# EAGLE design mic-preamp (EAGLE 6.5.0)
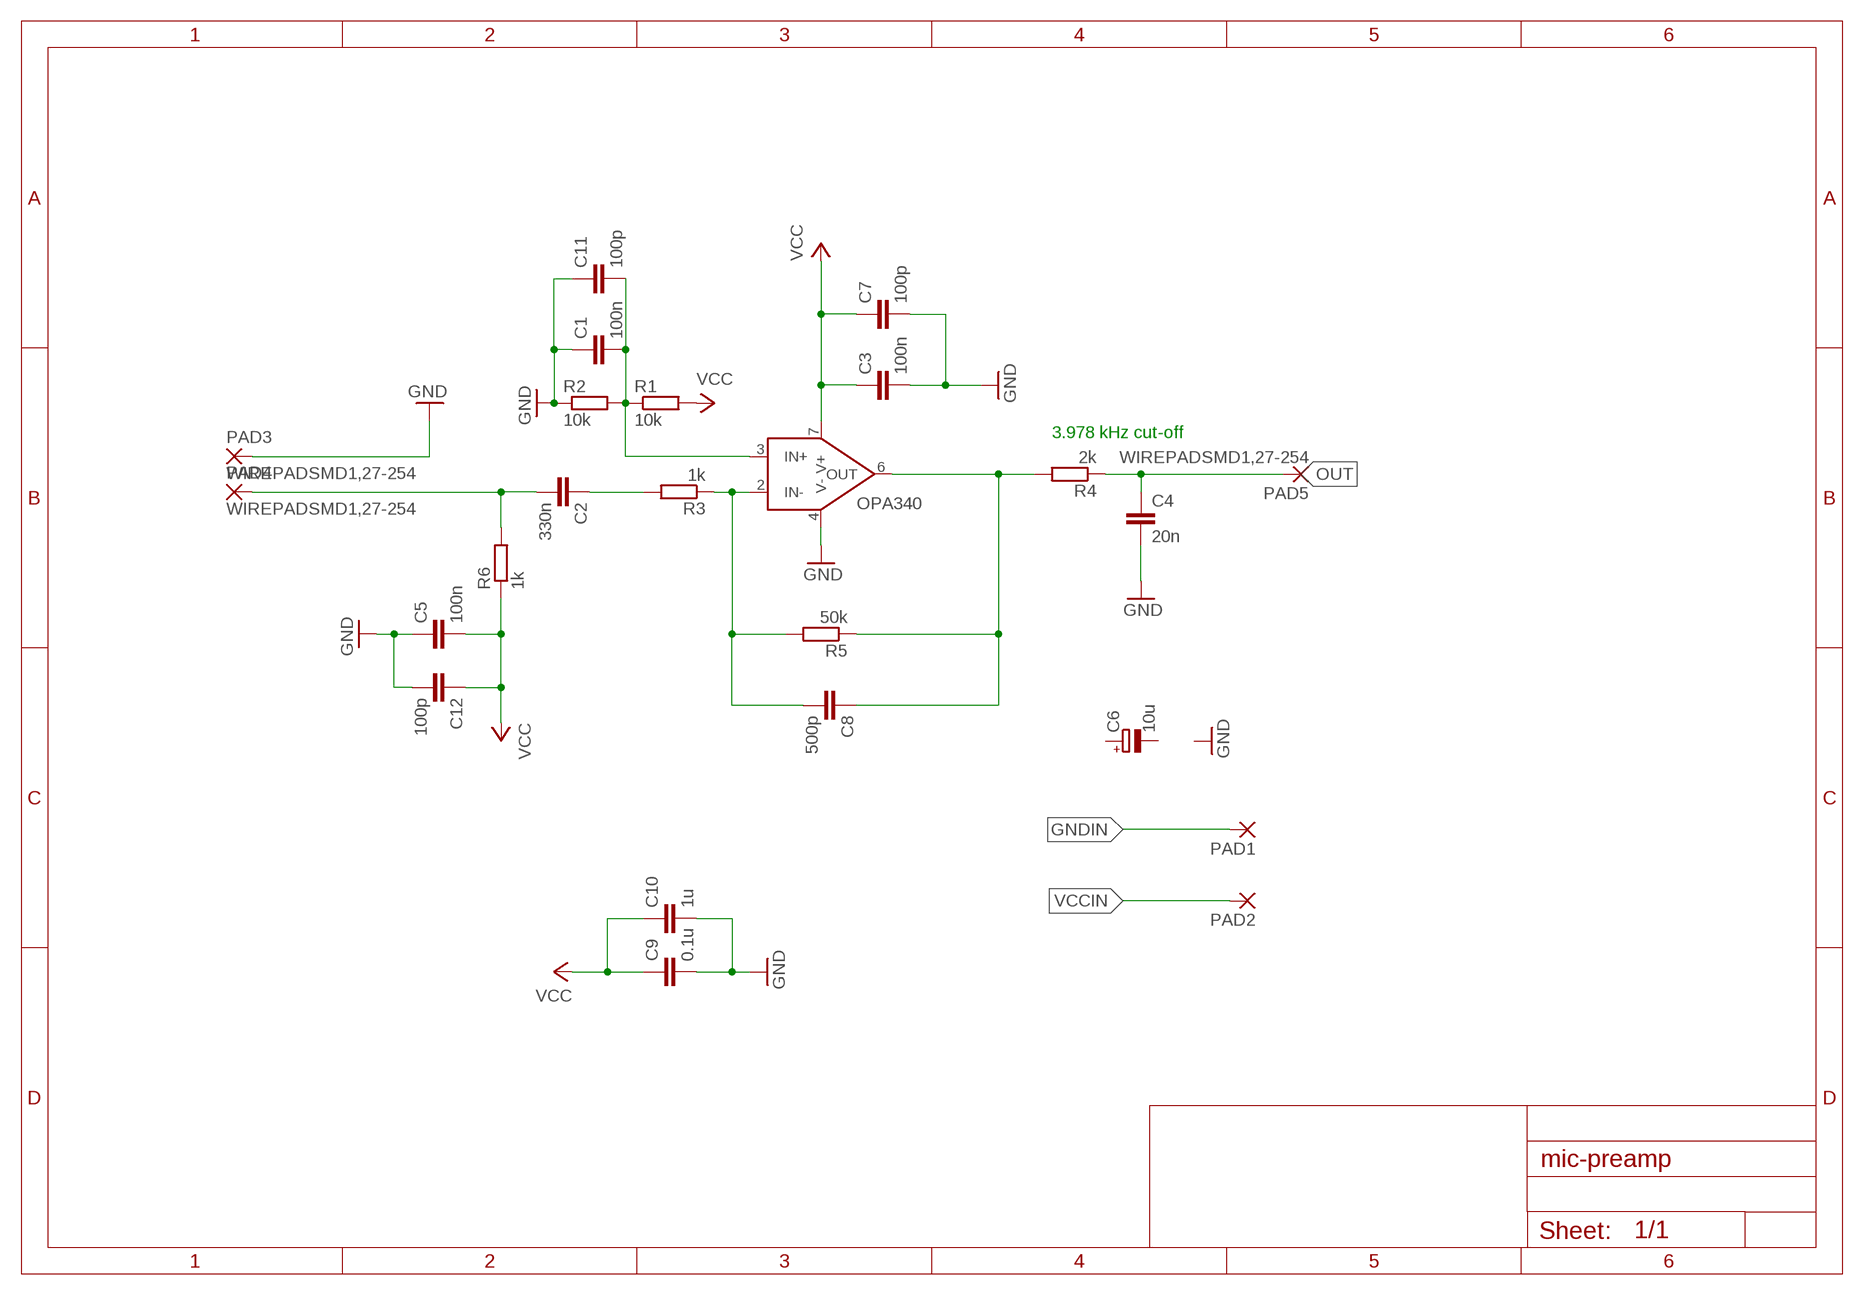
[diagram p0: schematic, sheet 1]

## Parts
C1  100n  C-EUC0805  [C0805]
C2  330n  C-EUC0805  [C0805]
C3  100n  C-EUC0805  [C0805]
C4  20n  C-EUC0805  [C0805]
C5  100n  C-EUC0805  [C0805]
C6  10u  CPOL-EUE2,5-6E  [E2,5-6E]
C7  100p  C-EUC0805  [C0805]
C8  500p  C-EUC0805  [C0805]
C9  0.1u  C-EUC0805  [C0805]
C10  1u  C-EUC0805  [C0805]
C11  100p  C-EUC0805  [C0805]
C12  100p  C-EUC0805  [C0805]
OPA340  OPA340  [DIL08]
PAD1  WIREPADSMD2,54-5,08  [SMD2,54-5,08]
PAD2  WIREPADSMD2,54-5,08  [SMD2,54-5,08]
PAD3  WIREPADSMD1,27-254  [SMD1,27-2,54]
PAD4  WIREPADSMD1,27-254  [SMD1,27-2,54]
PAD5  WIREPADSMD1,27-254  [SMD1,27-2,54]
R1  10k  R-EU_R0805  [R0805]
R2  10k  R-EU_R0805  [R0805]
R3  1k  R-EU_R0805  [R0805]
R4  2k  R-EU_R0805  [R0805]
R5  50k  R-EU_R0805  [R0805]
R6  1k  R-EU_R0805  [R0805]

## Nets
GND: C1.1 C3.2 C4.2 C5.1 C7.2 C9.2 C10.2 C11.1 C12.2 OPA340.4(V-) PAD3.1(P) R2.1
GNDIN: PAD1.1(P)
MIC: C2.2 PAD4.1(P) R6.2
N$1: C8.1 OPA340.6(OUT) R4.2 R5.1
N$2: C1.2 C11.2 OPA340.3(IN+) R1.1 R2.2
N$4: C2.1 R3.2
N$5: C8.2 OPA340.2(IN-) R3.1 R5.2
OUT: C4.1 PAD5.1(P) R4.1
VCC: C3.1 C5.2 C7.1 C9.1 C10.1 C12.1 OPA340.7(V+) R1.2 R6.1
VCCIN: PAD2.1(P)
Unconnected: C6.+ C6.-

## Notes on the sheet
- 3.978 kHz cut-off

## Library data of the parts
C1-C5 C7-C12 = rcl:C-EU: CAPACITOR, European symbol
C6 = rcl:CPOL-EU: POLARIZED CAPACITOR, European symbol
OPA340 = opa340:OPA340
PAD1-PAD5 = wirepad:WIREPAD: Wire PAD connect wire on PCB
R1-R6 = rcl:R-EU_: RESISTOR, European symbol

## Board
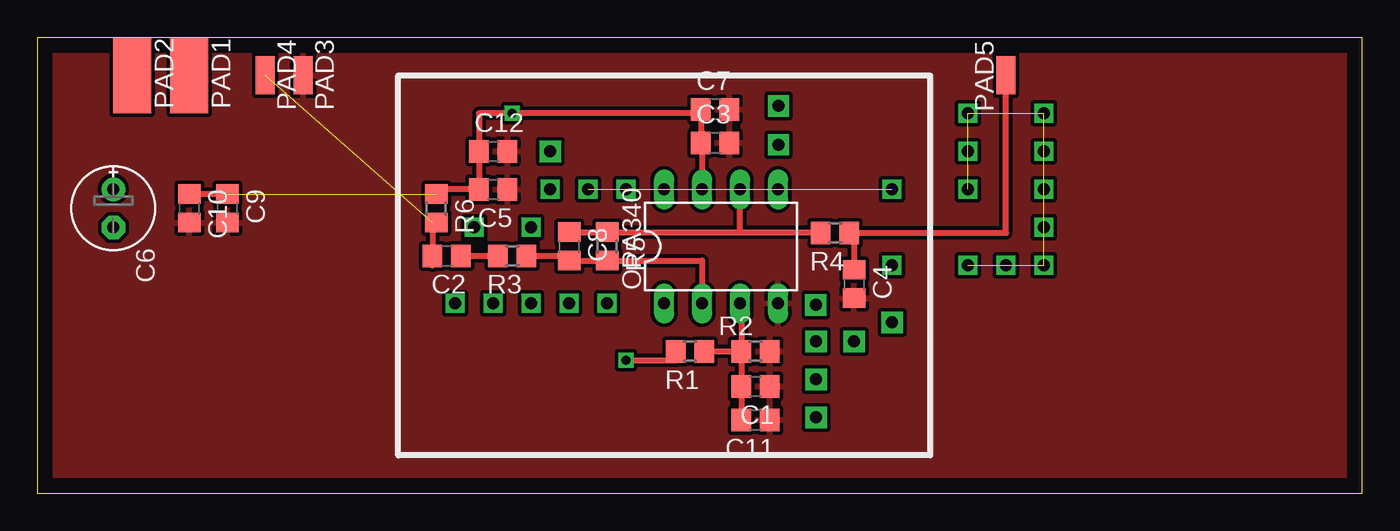
[diagram p1: board, top side]
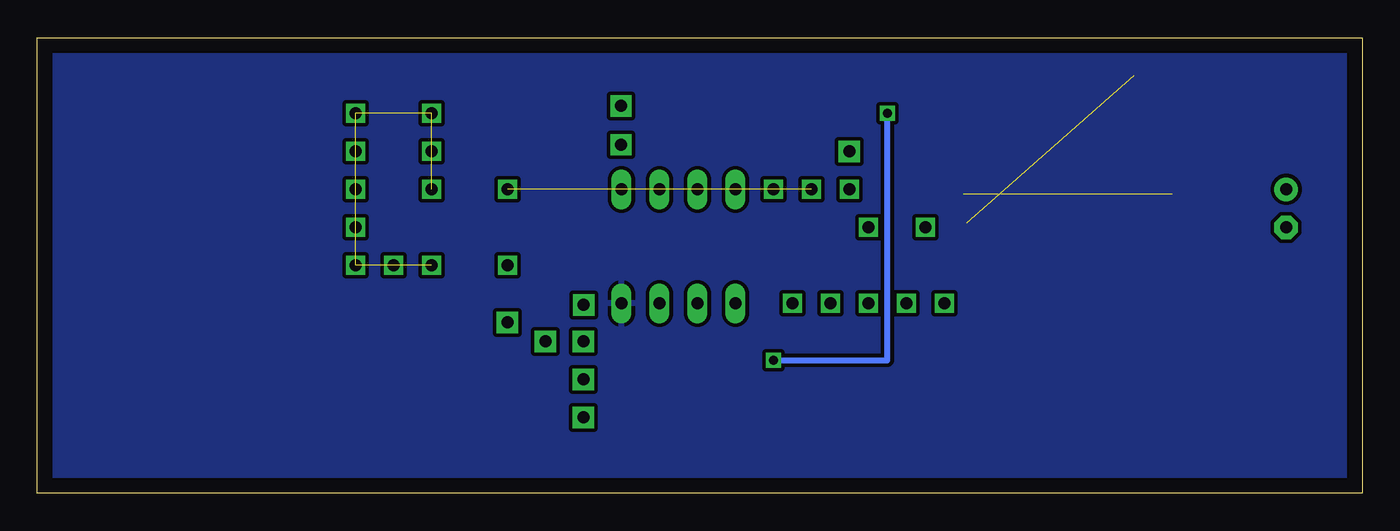
[diagram p2: board, bottom side, seen from below]

Size 88.58 x 30.47 mm. Coordinates in mm from the lower left corner, seen from the top.
Outline: 0,0 88.58,0 88.58,30.47 0,30.47 0,0
Copper layers (1*16): Top 0.035mm / dielectric 1.5mm / Bottom 0.035mm
Design rules "default *": minimum track width 10mil, minimum drill 24mil, track to track 10mil, track to pad 10mil, pad to pad 12mil, via to via 12mil, smd to smd 8mil, copper to edge 40mil, drill to drill 8mil, minimum pad ring 10mil, minimum via ring 8mil, stop-mask expansion 4mil, vias tented up to drill 0mil, thermal gap 10mil

### Footprints (pad centres in the part's own frame; a part is rotated, then mirrored left to right if it is on the bottom)
C0805 = smd 1.3 x 1.5: 1 -0.95,0; 2 0.95,0
E2,5-6E = drill 0.813 pad 1.575: + -1.27,0 | drill 0.813 pad 1.575 octagon: - 1.27,0
DIL08 = drill 0.813 long: 1 -3.81,-3.81; 2 -1.27,-3.81; 3 1.27,-3.81; 4 3.81,-3.81; 5 3.81,3.81; 6 1.27,3.81; 7 -1.27,3.81; 8 -3.81,3.81
SMD2,54-5,08 = smd 2.54 x 5.08: 1 0,0
SMD1,27-2,54 = smd 1.27 x 2.54: 1 0,0
R0805 = smd 1.3 x 1.5: 1 -0.95,0; 2 0.95,0

### Placement (x,y rotation side)
C1  48.02,7.15 180 top
C2  27.37,15.88 180 top
C3  45.32,23.43 0 top
C4  54.61,14 270 top
C5  30.48,20.32 180 top
C6  5.08,19.05 270 top
C7  45.32,25.67 0 top
C8  35.56,16.51 270 top
C9  12.7,19.05 270 top
C10  10.16,19.05 270 top
C11  48.02,4.91 180 top
C12  30.48,22.86 0 top
OPA340  45.72,16.51 0 top
PAD1  10.16,27.94 180 top
PAD2  6.35,27.94 180 top
PAD3  17.78,27.94 180 top
PAD4  15.24,27.94 180 top
PAD5  64.77,27.94 0 top
R1  43.64,9.49 180 top
R2  48.02,9.49 180 top
R3  31.75,15.88 180 top
R4  53.34,17.41 180 top
R5  38.1,16.51 270 top
R6  26.67,19.05 270 top

### Tracks (layer width: path | path; a pad name or v marks a point on that pad's centre or on a via)
GND
  pour Bottom: 0,30.48 88.9,30.48 88.9,0 0,0
  pour Top: 0,30.48 88.9,30.48 88.9,0 0,0
MIC  (1 unrouted)
  Top 0.406: R6.2 26.42,18.1 C2.2 26.42,15.24
N$1
  Top 0.406: C8.1 R5.1 46.99,17.46 | 46.99,17.46 OPA340.6 | 46.99,17.46 52.39,17.46 R4.2
N$2
  Top 0.406: 47.07,8.89 R2.2 47.07,12.7 OPA340.3 | 47.07,8.89 C1.2 C11.2 | R1.1 46.99,9.49 46.99,8.89 47.07,8.89
N$3  (via drill 0.8 pad 1.27)  (1 unrouted)
  other vias: 57.15,20.32 36.83,20.32
N$4
  Top 0.406: C2.1 R3.2
N$5
  Top 0.406: R3.1 35.56,15.88 C8.2 R5.2 44.45,15.56 OPA340.2
N$6  (via drill 0.8 pad 1.27)
  other vias: 57.15,15.24
N$7  (via drill 0.8 pad 1.27)
  other vias: 27.94,12.7
N$8  (via drill 0.8 pad 1.27)
  other vias: 30.48,12.7
N$9  (via drill 0.8 pad 1.27)
  other vias: 33.02,12.7
N$10  (via drill 0.8 pad 1.27)
  other vias: 35.56,12.7
N$11  (via drill 0.8 pad 1.27)
  other vias: 38.1,12.7
N$12  (via drill 0.8 pad 1.27)
  other vias: 29.21,17.78
N$13  (via drill 0.8 pad 1.27)
  other vias: 33.02,17.78
N$14  (via drill 0.8 pad 1.27)
  other vias: 34.29,20.32
N$15  (via drill 0.8 pad 1.27)  (9 unrouted)
  other vias: 62.23,15.24 64.77,15.24 67.31,15.24 67.31,17.78 67.31,20.32 67.31,22.86 67.31,25.4 62.23,25.4 62.23,22.86 62.23,20.32
N$16  (via drill 0.8 pad 1.27)
  other vias: 39.37,20.32
N$18  (via drill 0.8 pad 1.42)
  other vias: 52.05,12.6
N$19  (via drill 0.8 pad 1.42)
  other vias: 52.07,10.16
N$20  (via drill 0.8 pad 1.42)
  other vias: 52.07,7.62
N$22  (via drill 0.8 pad 1.42)
  other vias: 52.07,5.08
N$23  (via drill 0.8 pad 1.42)
  other vias: 54.61,10.16
N$24  (via drill 0.8 pad 1.42)
  other vias: 57.15,11.43
N$25  (via drill 0.8 pad 1.42)
  other vias: 34.29,22.86
N$26  (via drill 0.8 pad 1.42)
  other vias: 49.55,23.3
N$27  (via drill 0.8 pad 1.42)
  other vias: 49.55,25.9
OUT
  Top 0.406: R4.1 54.61,17.41 | 54.61,17.41 C4.1 | 54.61,17.41 64.77,17.41 PAD5.1
VCC  (via drill 0.6)  (1 unrouted)
  Top 0.406: OPA340.7 44.45,24.13 C3.1 C7.1 44.77,25.4 v31.75,25.4 29.53,25.4 C12.1 C5.2 26.67,20.32 R6.1 | v39.37,8.89 42.69,8.89 R1.2 | C9.1 C10.1
  Bottom 0.406: v39.37,8.89 31.75,8.89 v31.75,25.4